# Altium schematic sheet radioslave.SchDoc
size A4
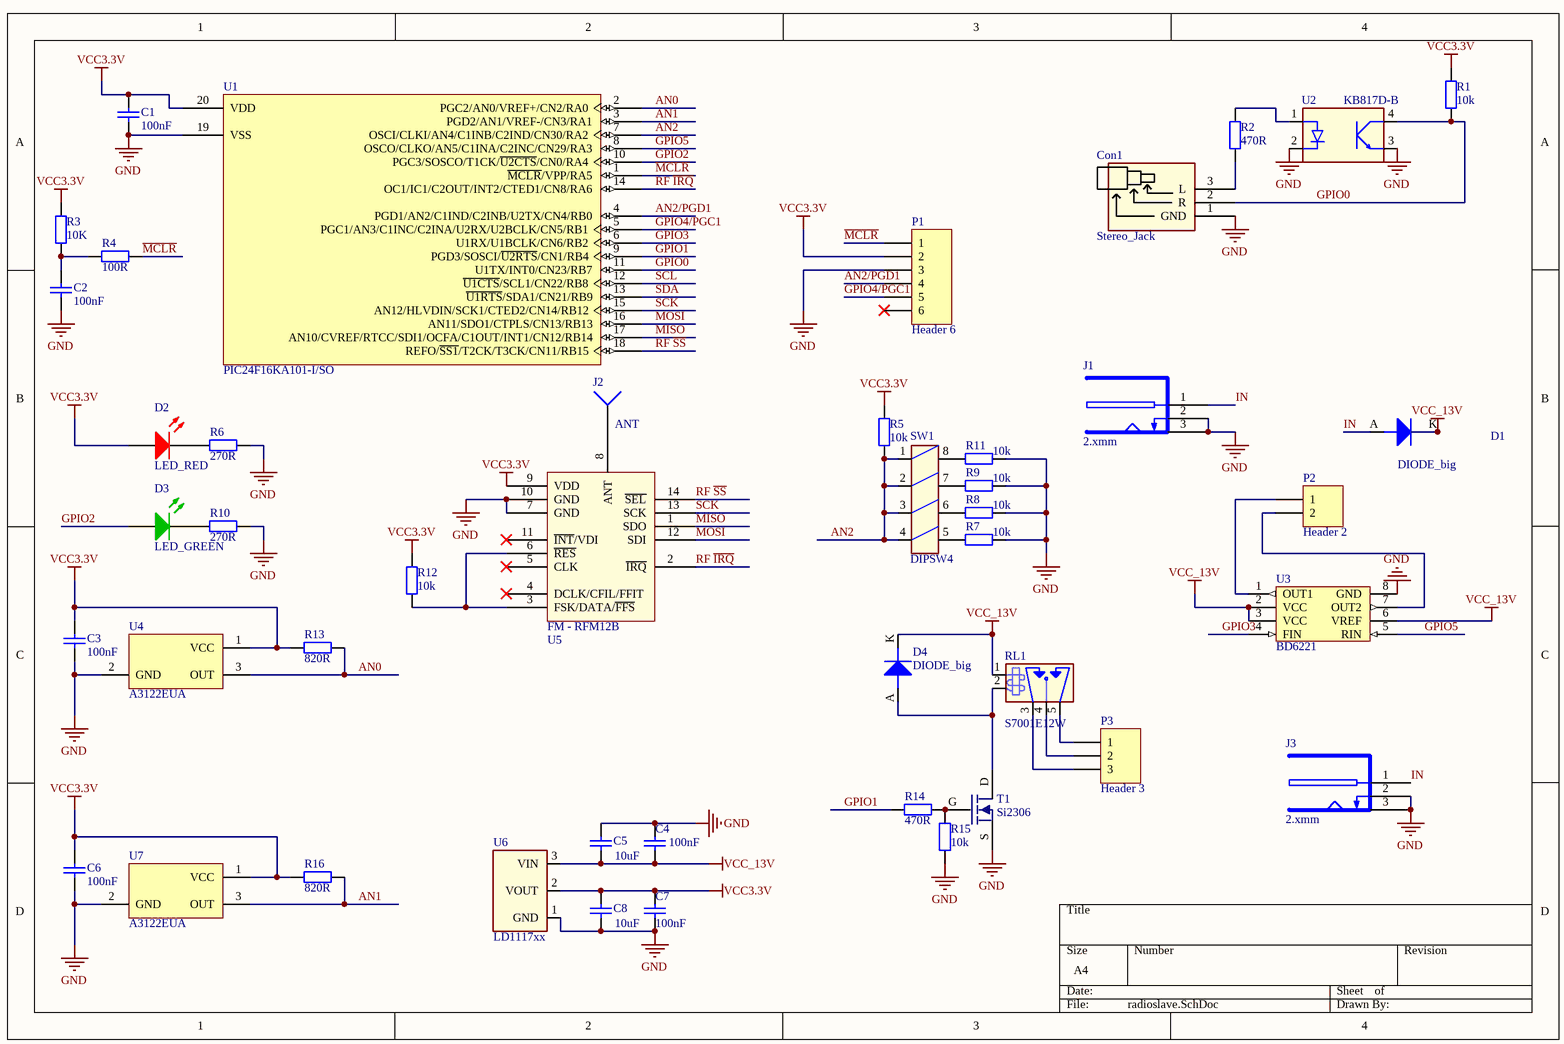
[diagram p0: radioslave.SchDoc]

## Parts
C1  100nF  [FP_0805_CAP_060]
C2  100nF  [FP_0805_CAP_060]
C3  100nF  [FP_0805_CAP_060]
C4  100nF  [FP_0603_CAP_080]
C5  10uF  [FP_1206_CAP_085]
C6  100nF  [FP_0805_CAP_060]
C7  100nF  [FP_0603_CAP_080]
C8  10uF  [FP_1206_CAP_085]
Con1  Stereo_Jack  [STEREO_JACK]
D1  DIODE_big  [FP_SMA DO214AC]
D2  LED_RED  [FP_0805_LED_RED]
D3  LED_GREEN  [FP_0805_LED_RED]
D4  DIODE_big  [FP_SMA DO214AC]
J1  2.xmm  [FP_DC_TAP_ANYA]
J2  ANT  [PIN1]
J3  2.xmm  [FP_DC_TAP_ANYA]
P1  Header 6  [HDR1X6]
P2  Header 2  [HDR1X2]
P3  Header 3  [SORKAPOCS 3 P RM3.81]
R1  10k  [FP_0805_RES]
R2  470R  [FP_0805_RES]
R3  10K  [FP_0805_RES]
R4  100R  [FP_0805_RES]
R5  10k  [FP_0805_RES]
R6  270R  [FP_0805_RES]
R7  10k  [FP_0805_RES]
R8  10k  [FP_0805_RES]
R9  10k  [FP_0805_RES]
R10  270R  [FP_0805_RES]
R11  10k  [FP_0805_RES]
R12  10k  [FP_0805_RES]
R13  820R  [FP_0805_RES]
R14  470R  [FP_0805_RES]
R15  10k  [FP_0805_RES]
R16  820R  [FP_0805_RES]
RL1  S7001E12W  [RELAY_MORSE]
SW1  DIPSW4  [DIP switch 4 TH]
T1  Si2306  [FET_SOT23]
U1  PIC24F16KA101-I/SO  [SOIC-SO20_N]
U2  KB817D-B  [SOP-4L]
U3  BD6221  [DIGITAL_SOIC8]
U4  A3122EUA  [Allegro_hall sensor]
U5  RFM12B  [RFM12B-S1]  (value not drawn)
U6  LD1117xx  [SUPPLY_SOT223]
U7  A3122EUA  [Allegro_hall sensor]

## Nets
GND: C1.1 C2.1 C3.1 C4.1 C5.2 C6.1 C7.2 C8.1 Con1.1(GND) J1.2(GND) J1.3(GND) J3.2(GND) J3.3(GND) P1.3 R6.1 R7.1 R8.1 R9.1 R10.1 R11.1 R15.1 T1.S U1.19(VSS) U2.2(K) U2.3(E) U3.8(GND) U4.2(GND) U5.7(GND) U5.10(GND) U6.1(GND) U7.2(GND)
VCC3.3V: C1.2 C3.2 C6.2 C7.1 C8.2 D2.A P1.2 R1.1 R3.1 R5.1 R12.2 R13.2 R16.2 U1.20(VDD) U4.1(VCC) U5.9(VDD) U6.2(VOUT) U7.1(VCC)
VCC_13V: C4.2 C5.1 D1.K D4.K RL1.1(COIL1-) U3.2(VCC) U3.3(VCC) U3.6(VREF) U6.3(VIN)
AN0: R13.1 U1.2(PGC2/AN0/VREF+/CN2/RA0) U4.3(OUT)
AN1: R16.1 U1.3(PGD2/AN1/VREF-/CN3/RA1) U7.3(OUT)
AN2: R5.2 SW1.1 SW1.2 SW1.3 SW1.4 U1.7(OSCI/CLKI/AN4/C1INB/C2IND/CN30/RA2)
AN2/PGD1: P1.4 U1.4(PGD1/AN2/C1IND/C2INB/U2TX/CN4/RB0)
GPIO0: Con1.2(R) R1.2 U1.11(U1TX/INT0/CN23/RB7) U2.4(C)
GPIO1: R14.2 U1.9(PGD3/SOSCI/~{U2RTS}/CN1/RB4)
GPIO2: D3.A U1.10(PGC3/SOSCO/T1CK/~{U2CTS}/CN0/RA4)
GPIO3: U1.6(U1RX/U1BCLK/CN6/RB2) U3.4(FIN)
GPIO4/PGC1: P1.5 U1.5(PGC1/AN3/C1INC/C2INA/U2RX/U2BCLK/CN5/RB1)
GPIO5: U1.8(OSCO/CLKO/AN5/C1INA/C2INC/CN29/RA3) U3.5(RIN)
IN: D1.A J1.1(9V) J3.1(9V)
~{MCLR}: P1.1 R4.1 U1.1(~{MCLR}/VPP/RA5)
MISO: U1.17(AN10/CVREF/RTCC/SDI1/OCFA/C1OUT/INT1/CN12/RB14) U5.1(SDO)
MOSI: U1.16(AN11/SDO1/CTPLS/CN13/RB13) U5.12(SDI)
RF ~{IRQ}: U1.14(OC1/IC1/C2OUT/INT2/CTED1/CN8/RA6) U5.2(~{IRQ})
RF ~{SS}: U1.18(REFO/~{SS1}/T2CK/T3CK/CN11/RB15) U5.14(~{SEL})
SCK: U1.15(AN12/HLVDIN/SCK1/CTED2/CN14/RB12) U5.13(SCK)
SCL: U1.12(~{U1CTS}/SCL1/CN22/RB8)
SDA: U1.13(~{U1RTS}/SDA1/CN21/RB9)
NetC2_2: C2.2 R3.2 R4.2
NetCon1_3: Con1.3(L) R2.2
NetD2_K: D2.K R6.2
NetD3_K: D3.K R10.2
NetD4_A: D4.A RL1.2(COIL2+) T1.D
NetJ2_1: J2.1 U5.8(ANT)
NetP2_1: P2.1 U3.1(OUT1)
NetP2_2: P2.2 U3.7(OUT2)
NetP3_1: P3.1 RL1.5(NO)
NetP3_2: P3.2 RL1.4(COMMON)
NetP3_3: P3.3 RL1.3(NC)
NetR2_1: R2.1 U2.1(A)
NetR7_2: R7.2 SW1.5
NetR8_2: R8.2 SW1.6
NetR9_2: R9.2 SW1.7
NetR11_2: R11.2 SW1.8
NetR12_1: R12.1 U5.3(FSK/DATA/~{FFS}) U5.6(~{RES})
NetR14_1: R14.1 R15.2 T1.G

Not connected (* = marked no-connect by the designer): P1 6*; U5 4(DCLK/CFIL/FFIT)* 5(CLK)* 11(~{INT}/VDI)*

## Notes on the sheet
- (in symbol RFM12B) FM - RFM12B

## Library data of the parts
C1-C4 C6 C7 = Cap: Capacitor; Order info: TODO; Tűrés: 10%; Published: 8-Jun-2000; LatestRevisionDate: 17-Jul-2002; LatestRevisionNote: Re-released for DXP Platform.; PackageReference: RAD-0.3; Publisher: Altium Limited; Value: 100nF
C5 C8 = Cap: Capacitor; Value: 100nF; Tűrés: 20% X7R; Order info: TODO; Published: 8-Jun-2000; LatestRevisionDate: 17-Jul-2002; LatestRevisionNote: Re-released for DXP Platform.; PackageReference: RAD-0.3; Publisher: Altium Limited; Order info: 82-07-81
D2 = LED_R: Typical LED
D3 = LED_G: Typical LED
J1 J3 = DC_TAP_ANYA: 2.xmm DC HEBA25 TÁPFESZÜLTSÉG ALJZAT ZÁRT, NYÁKBA 90°; Supplier: Lomex 43-07-67
J2 = Socket: LatestRevisionDate: 17-Jul-2002; LatestRevisionNote: Re-released for DXP Platform.; Publisher: Altium Limited
P1 = Header 6: Header, 6-Pin; LatestRevisionDate: 17-Jul-2002; LatestRevisionNote: Re-released for DXP Platform.; Publisher: Altium Limited
P2 = Header 2: Header, 2-Pin; LatestRevisionDate: 17-Jul-2002; LatestRevisionNote: Re-released for DXP Platform.; Publisher: Altium Limited
P3 = Header 3: Header, 3-Pin; LatestRevisionDate: 17-Jul-2002; LatestRevisionNote: Re-released for DXP Platform.; Publisher: Altium Limited
R1-R16 = Res3: Resistor; Value: 1k; Order info: TODO; Tűrés: 5%; Published: 8-Jun-2000; LatestRevisionDate: 04-Mar-2005; LatestRevisionNote: PCB Footprint replaced.; PackageReference: J1-0603; Publisher: Altium Limited
RL1 = RELAY_MORSE: S7001E12W  12V morse 230AC/10A; LOMEX:: [42-16-43]
T1 = NMOS
U1 = PIC24F16KA101-I/SO: 16-Bit Flash Microcontroller with nanoWatt XLP Technology, 16KB Flash, 1.5KB SRAM, 20-Pin SOIC, Industrial Temperature; FirstPublished: 2-Dec-2009; DatasheetVersion: revB, Mar-2009; PackageVersion: revBB, Aug-2009; PackageReference: SOIC-SO20; Publisher: Altium Limited; PackageDescription: 20-Lead Plastic Small Outline (SO) - Wide 7.50mm Body [SOIC]; Supplier 1: Digi-Key; Supplier Part Number 1: PIC24F16KA101-I/SO-ND; Supplier 2: Farnell; Supplier Part Number 2: 1707627; Supplier 3: Newark; Supplier Part Number 3: 40M1459; Code_JEDEC: MS-013-AC; Code_IPC: SOIC127P1030-20; ComponentLink1Description: Datasheet; ComponentLink1URL: http://ww1.microchip.com/downloads/en/DeviceDoc/PIC24F16KA102_Family_datasheet_39927b.pdf; ComponentLink2Description: Packaging Specification; ComponentLink2URL: http://www.microchip.com/stellent/groups/techpub_sg/documents/packagingspec/en012702.pdf; ComponentLink3Description: Microchip.com Home; ComponentLink3URL: http://www.microchip.com/
U2 = KB817D-B: KB817D-B (KIN) SOP-4L OPTOCOUPLER TRANS-OUT 300-600% 5kV SOP-4L [84-00-48]
U3 = BD6221: H_bridge
U4 U7 = A3122EUA: Hall-Effect Switch for High-Temperature Operation; ComponentAvailability: Not for New Design; Published: 13-Oct-2000; LatestRevisionDate: 17-Jul-2002; LatestRevisionNote: Re-released for DXP Platform.; DatasheetVersion: 1995; PackageVersion: 1995; PackageReference: UA3; Publisher: Altium Limited; PackageDescription: SIP; 3 Leads; Body 3 x 4 x 1.5 mm (typ); Pitch 1.27 mm; ComponentLink1Description: Manufacturer Link; ComponentLink1URL: http://www.allegromicro.com/; ComponentLink2Description: Datasheet; ComponentLink2URL: http://www.allegromicro.com/datafile/3121.pdf; ComponentLink3Description: Discontinuation Notice; ComponentLink3URL: http://www.allegromicro.com/sf/3121/
U5 = RFM12B: FM Module
U6 = LD1117xx: LD1117xx 3,3V lin reg; Order info: TODO; Order info: http://hu.mouser.com/ProductDetail/NXP/NX1117C33Z115/?qs=%2fha2pyFadui8%252bOpsKr9N%2fhvfdxjCMx%252bF0NTwqG%252bWOJY%3d